# EAGLE design ONET8501P-breakout (EAGLE 9.4.1)
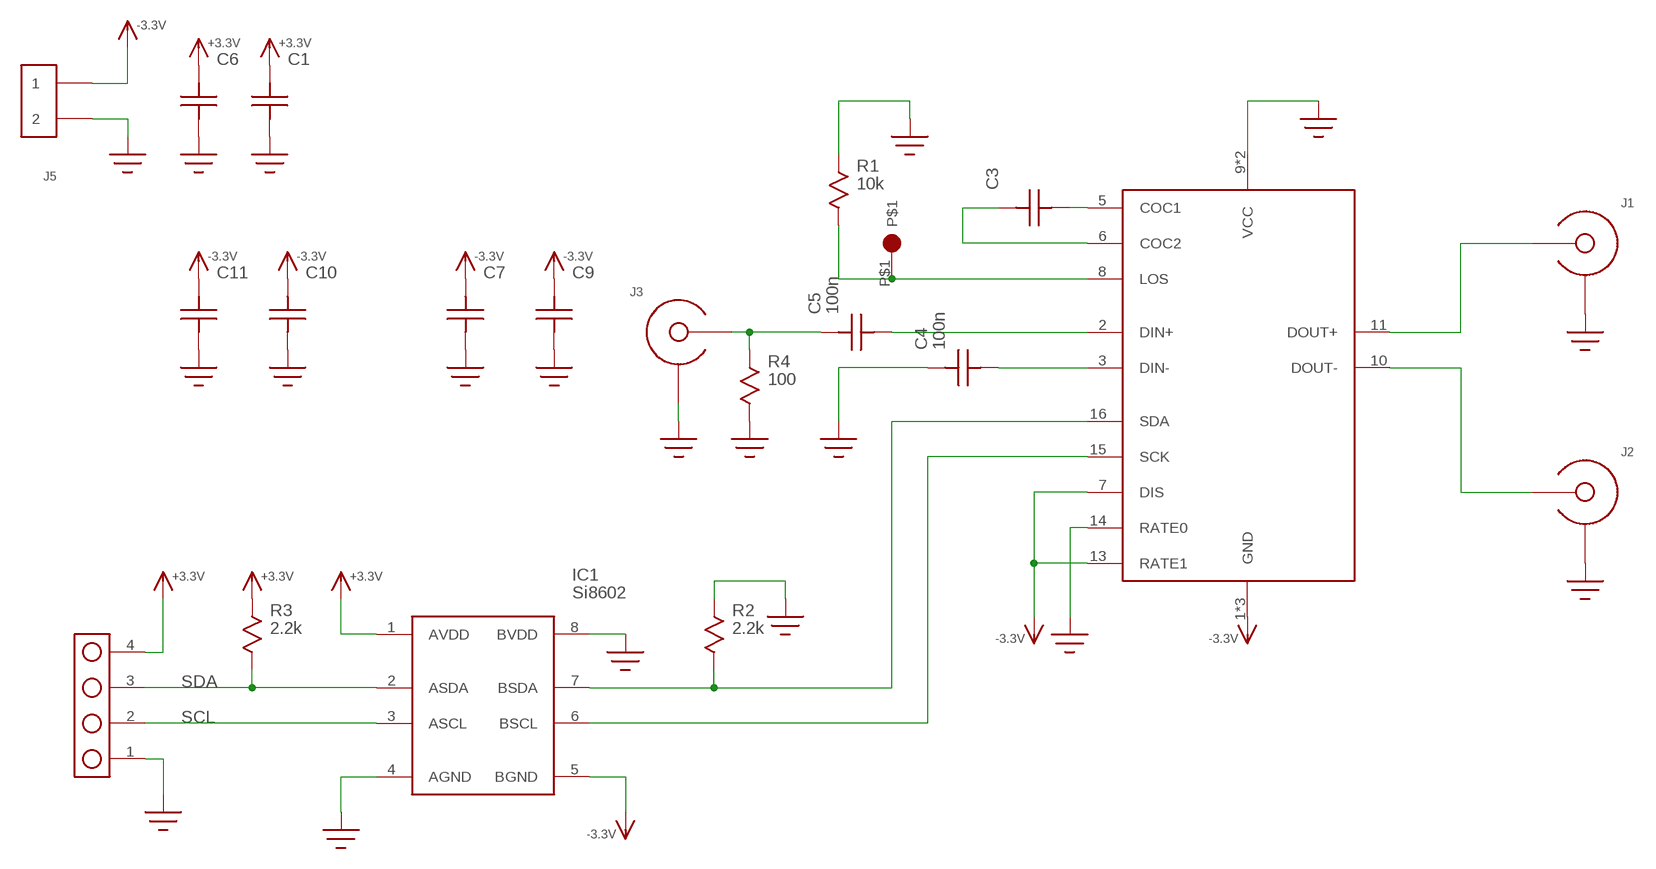
[diagram p0: schematic, sheet 1]

## Parts
C1  C0603  [C0603]
C3  C0603  [C0603]
C4  100n  C0603  [C0603]
C5  100n  C0603  [C0603]
C6  C1206  [1206]
C7  C1206  [1206]
C9  C0603  [C0603]
C10  C0603  [C0603]
C11  C0603  [C0603]
IC1  Si8602  SI8602  [SOIC8]
IC2  ONET8501P  [TQFN16-EP]
J1  SMA-EDGE-LAUNCH4L_4035_TAPER  [SMA_EDGE_LAUNCH_4L_4035_TAPER]
J2  SMA-EDGE-LAUNCH4L_4035_TAPER  [SMA_EDGE_LAUNCH_4L_4035_TAPER]
J3  SMA-EDGE-LAUNCH4L_4035_TAPER  [SMA_EDGE_LAUNCH_4L_4035_TAPER]
J4  HEADER_4PIN  [HEADER_4PIN]
J5  HEADER_2PIN  [HEADER_2PIN]
P1  ICSP_PAD  [ICSP_PAD]
R1  10k  R0603  [R0603]
R2  2.2k  R0603  [R0603]
R3  2.2k  R0603  [R0603]
R4  100  R0603  [R0603]

## Nets
+3.3V: C1.P$2 C6.P$2 IC1.1(AVDD) J4.4 R3.P$1
-3.3V: C7.P$2 C9.P$2 C10.P$2 C11.P$2 IC1.5(BGND) IC2.1(GND) IC2.4(GND) IC2.7(DIS) IC2.13(RATE1) IC2.EP(GND) J5.1
GND: C1.P$1 C4.P$2 C6.P$1 C7.P$1 C9.P$1 C10.P$1 C11.P$1 IC1.4(AGND) IC1.8(BVDD) IC2.9(VCC) IC2.12(VCC) IC2.14(RATE0) J1.BOTTOM_GND(SHIELD) J1.GND@1(SHIELD) J1.GND@2(SHIELD) J1.GND@3(SHIELD) J1.GND@4(SHIELD) J1.GND@5(SHIELD) J1.GND@6(SHIELD) J1.GND@7(SHIELD) J1.GND@8(SHIELD) J1.GND@14(SHIELD) J1.GND@15(SHIELD) J1.GND@16(SHIELD) J1.GND@17(SHIELD) J1.GND_PAD1(SHIELD) J1.GND_PAD2(SHIELD) J1.P$1(SHIELD) J1.P$2(SHIELD) J2.BOTTOM_GND(SHIELD) J2.GND@1(SHIELD) J2.GND@2(SHIELD) J2.GND@3(SHIELD) J2.GND@4(SHIELD) J2.GND@5(SHIELD) J2.GND@6(SHIELD) J2.GND@7(SHIELD) J2.GND@8(SHIELD) J2.GND@14(SHIELD) J2.GND@15(SHIELD) J2.GND@16(SHIELD) J2.GND@17(SHIELD) J2.GND_PAD1(SHIELD) J2.GND_PAD2(SHIELD) J2.P$1(SHIELD) J2.P$2(SHIELD) J3.BOTTOM_GND(SHIELD) J3.GND@1(SHIELD) J3.GND@2(SHIELD) J3.GND@3(SHIELD) J3.GND@4(SHIELD) J3.GND@5(SHIELD) J3.GND@6(SHIELD) J3.GND@7(SHIELD) J3.GND@8(SHIELD) J3.GND@14(SHIELD) J3.GND@15(SHIELD) J3.GND@16(SHIELD) J3.GND@17(SHIELD) J3.GND_PAD1(SHIELD) J3.GND_PAD2(SHIELD) J3.P$1(SHIELD) J3.P$2(SHIELD) J4.1 J5.2 R1.P$1 R2.P$1 R4.P$2
N$3: IC1.7(BSDA) IC2.16(SDA) R2.P$2
N$4: IC1.6(BSCL) IC2.15(SCK)
N$5: C3.P$1 IC2.5(COC1)
N$6: C3.P$2 IC2.6(COC2)
N$7: IC2.11(DOUT+) J1.CENTER@1(CENTER)
N$8: IC2.10(DOUT-) J2.CENTER@1(CENTER)
N$9: IC2.8(LOS) P1.P$1 R1.P$2
N$10: C4.P$1 IC2.3(DIN-)
N$11: C5.P$2 J3.CENTER@1(CENTER) R4.P$1
N$12: C5.P$1 IC2.2(DIN+)
SCL: IC1.3(ASCL) J4.2
SDA: IC1.2(ASDA) J4.3 R3.P$2

## Library data of the parts
C1 C3-C7 C9-C11 = yapo:C
IC1 = yapo:SI8602
IC2 = yapo:ONET8501P
J1-J3 = sma_footprint_2l:SMA-EDGE-LAUNCH
J4 = yapo:HEADER_4PIN
J5 = yapo:HEADER_2PIN
P1 = yapo:ICSP_PAD
R1-R4 = yapo:R

## Board
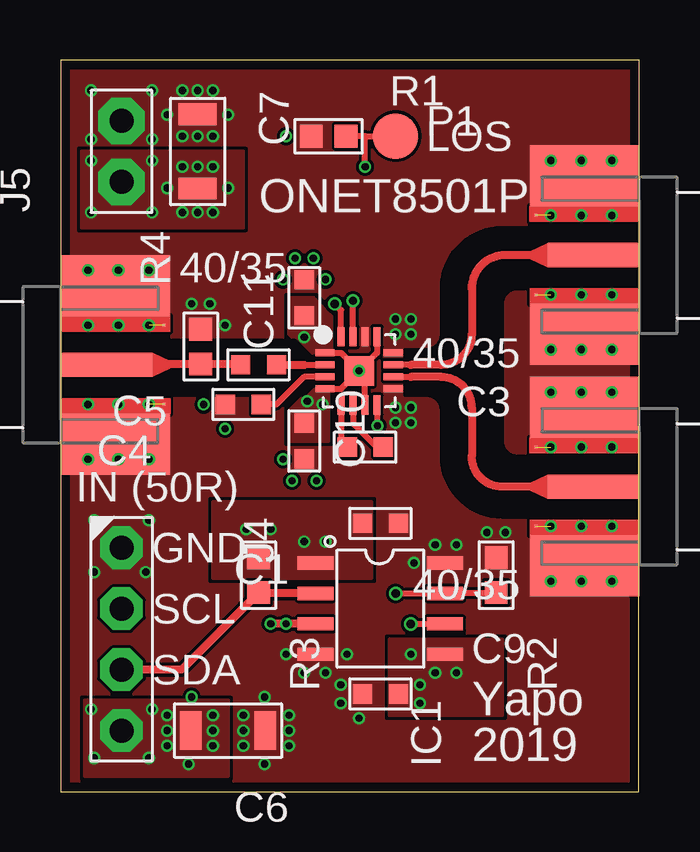
[diagram p1: board, top side]
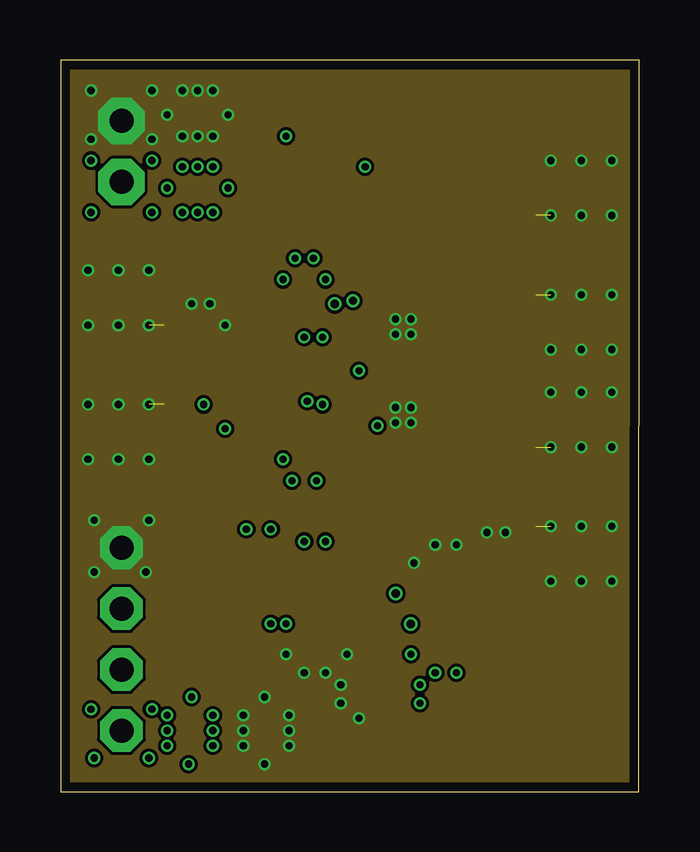
[diagram p2: board, inner layer Route2]
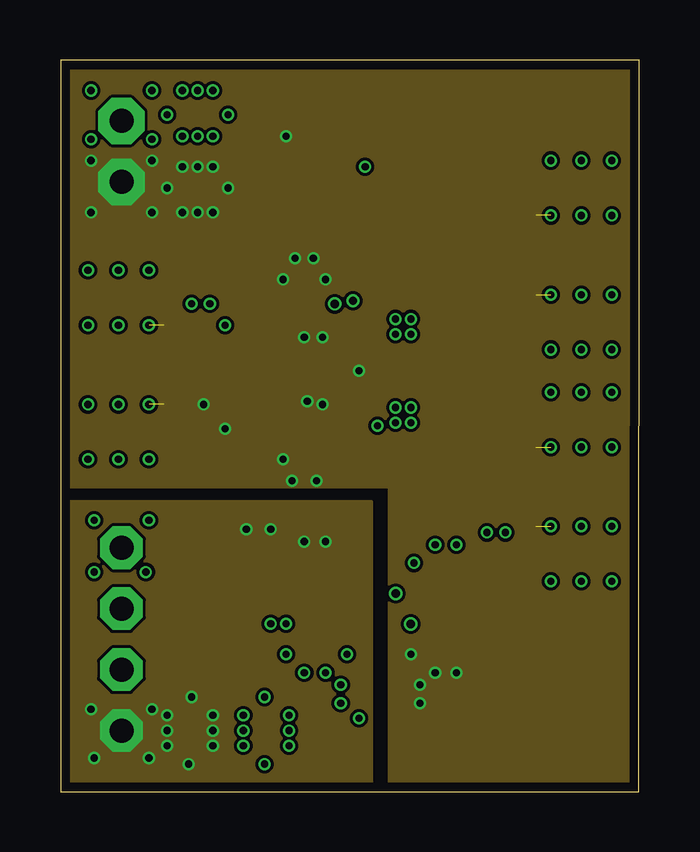
[diagram p3: board, inner layer Route15]
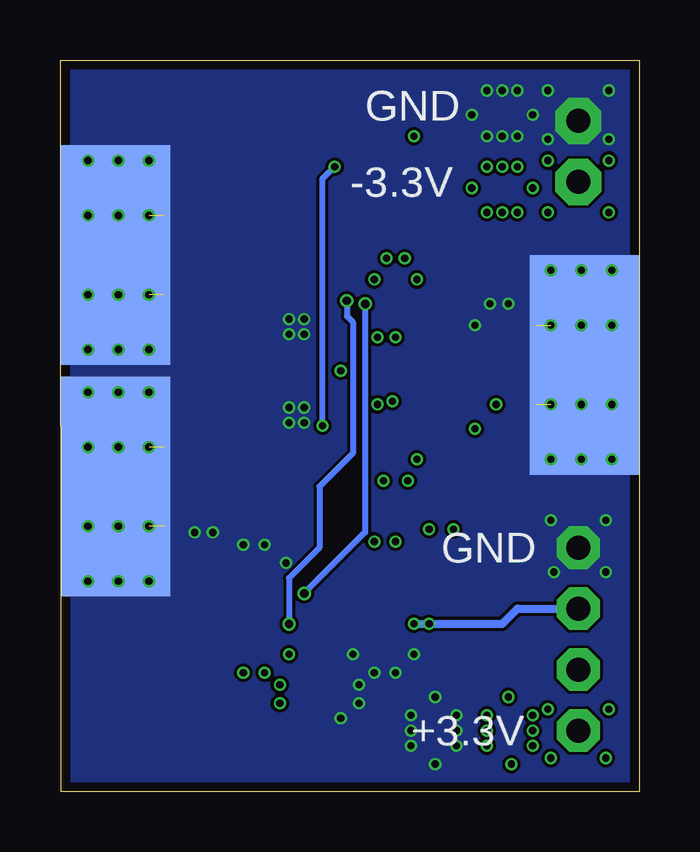
[diagram p4: board, bottom side, seen from below]

Size 24.13 x 30.48 mm. Coordinates in mm from the lower left corner, seen from the top.
Outline: 0,0 24.11,0 24.13,30.48 0,30.48 0,0
Copper layers (1*2*15*16): Top 0.035559375mm / dielectric 0.17018125mm / Route2 0.01778125mm / dielectric 47mil / Route15 0.01778125mm / dielectric 0.17018125mm / Bottom 0.035559375mm
Design rules "oshpark-4layer *": minimum track width 5mil, minimum drill 10mil, track to track 5mil, track to pad 5mil, pad to pad 5mil, via to via 5mil, smd to smd 5mil, copper to edge 15mil, drill to drill 6mil, minimum pad ring 4mil, minimum via ring 4mil, stop-mask expansion 2.5mil, vias tented up to drill 20mil, thermal gap 10mil

### Footprints (pad centres in the part's own frame; a part is rotated, then mirrored left to right if it is on the bottom)
C0603 = smd 0.8 x 0.8: P$1 -0.75,0; P$2 0.75,0
1206 = smd 0.9 x 1.6: P$1 -1.55,0; P$2 1.55,0
SOIC8 = smd 0.55 x 1.5: 1 -1.905,-2.7; 2 -0.635,-2.7; 3 0.635,-2.7; 4 1.905,-2.7; 5 1.905,2.7; 6 0.635,2.7; 7 -0.635,2.7; 8 -1.905,2.7
TQFN16-EP = smd 0.3 x 0.8: 1 -0.75,-1.425; 2 -0.25,-1.425; 3 0.25,-1.425; 4 0.75,-1.425; 9 0.75,1.425; 10 0.25,1.425; 11 -0.25,1.425; 12 -0.75,1.425 | smd 0.8 x 0.3: 5 1.425,-0.75; 6 1.425,-0.25; 7 1.425,0.25; 8 1.425,0.75; 13 -1.425,0.75; 14 -1.425,0.25; 15 -1.425,-0.25; 16 -1.425,-0.75 | smd 1.23 x 1.23: EP 0,0
SMA_EDGE_LAUNCH_4L_4035_TAPER = smd 4.572 x 9.144 bottom: BOTTOM_GND 2.286,0 | smd 3.81 x 1.016: CENTER@1 1.905,0 | drill 0.3: GND@1 1.143,3.937; GND@2 3.683,3.937; GND@3 1.143,1.651; GND@4 3.683,1.651; GND@5 1.143,-1.651; GND@6 3.683,-1.651; GND@7 1.143,-3.937; GND@8 3.683,-3.937; GND@14 2.413,3.937; GND@15 2.413,-3.937; GND@16 2.413,-1.651; GND@17 2.413,1.651 | smd 4.572 x 2.54: GND_PAD1 2.286,3.302; GND_PAD2 2.286,-3.302 | smd 0.127 x 0.127: P$1 4.318,1.651; P$2 4.318,-1.651
HEADER_4PIN = drill 1 pad 1.778 octagon: 1 -3.81,0; 2 -1.27,0; 3 1.27,0; 4 3.81,0
HEADER_2PIN = drill 1 pad 1.93 octagon: 1 -1.27,0; 2 1.27,0
ICSP_PAD = smd 1.905 x 1.905: P$1 0,0
R0603 = smd 0.95 x 0.95: P$1 -0.725,0; P$2 0.725,0

### Placement (x,y rotation side)
C1  13.34,11.18 180 top
C3  12.7,14.35 0 top
C4  7.62,16.13 180 top
C5  8.26,17.78 180 top
C6  6.99,2.54 180 top
C7  5.71,26.67 270 top
C9  13.34,4.06 0 top
C10  10.16,20.57 270 top
C11  10.16,14.61 90 top
IC1  13.34,7.62 270 top
IC2  12.45,17.53 270 top
J1  24.13,22.35 180 top
J2  24.13,12.7 180 top
J3  0,17.78 0 top
J4  2.54,6.35 270 top
J5  2.54,26.67 90 top
P1  13.97,27.3 0 top
R1  11.18,27.3 0 top
R2  18.16,9.02 270 top
R3  8.26,9.02 270 top
R4  5.84,18.54 90 top

### Tracks (layer width: path | path; a pad name or v marks a point on that pad's centre or on a via)
+3.3V  (via drill 0.3)
  other vias: 11.05,10.41 5.46,3.94 5.33,1.14 6.35,1.91 6.35,2.54 6.35,3.17 4.45,3.17 4.45,2.54 4.45,1.91 3.81,3.43 1.27,3.43 1.4,1.4 3.68,1.4 10.16,10.41 7.75,10.92 8.76,10.92
  pour Route15 (no thermals): 0,0 12.95,0 12.95,12.06 0,12.06
  pour Top (no thermals): 6.35,8.89 12.95,8.89 12.95,12.06 6.35,12.06
  pour Top (no thermals): 1.02,0.64 6.99,0.64 6.99,3.81 1.02,3.81
-3.3V  (via drill 0.3)
  Top 0.254: IC2.7 12.7,17.28 IC2.EP | IC2.13 13.2,18.28 IC2.EP | IC2.1 11.7,18.28 IC2.EP | IC2.4 11.7,16.78 IC2.EP
  other vias: 10.92,18.92 10.92,16.13 10.29,16.26 10.16,18.92 12.45,17.53 5.71,26.04 5.71,24.13 5.08,26.04 6.35,26.04 6.35,24.13 5.08,24.13 4.45,25.15 6.99,25.15 3.81,24.13 1.27,24.13 1.27,26.29 3.81,26.29 9.4,27.3 9.78,22.23 10.54,22.23 11.05,21.34 9.27,21.34 6.86,15.11 5.97,16.13 9.27,13.84 9.65,12.95 10.67,12.95 15.62,4.95 16.51,4.95 14.99,4.45 14.61,5.71 14.99,3.68
  pour Route15 (no thermals): 0,30.48 24.13,30.48 24.13,0 13.72,0 13.72,12.7 0,12.7
  pour Top (no thermals): 13.72,6.35 13.72,3.17 18.41,3.17 18.41,6.35
  pour Top (no thermals): 9.53,14.61 11.18,14.61 11.18,16.76 10.41,16.76 9.53,15.88
  pour Top (no thermals): 9.53,20.57 10.54,20.57 11.3,19.81 11.3,18.29 10.16,18.29 10.16,18.41 9.53,19.05
  pour Top (no thermals): 0.89,26.67 7.62,26.67 7.62,23.5 0.89,23.5
GND  (via drill 0.3)  (6 unrouted)
  other vias: 13.97,19.05 13.97,16 14.61,19.05 14.61,19.68 13.97,19.68 14.61,16 14.61,15.37 13.97,15.37 6.86,19.43 6.22,20.32 5.46,20.32 5.08,27.3 5.71,27.3 6.35,27.3 6.99,28.19 4.45,28.19 5.08,29.21 5.71,29.21 6.35,29.21 3.81,29.21 1.27,29.21 1.27,27.18 3.81,27.18 18.54,10.79 17.78,10.79 15.62,10.29 16.51,10.29 11.94,5.71 14.73,9.53 9.4,5.71 10.16,4.95 11.05,4.95 11.68,4.45 11.68,3.68 12.45,3.05 8.51,3.94 8.51,1.14 9.53,3.17 9.53,2.54 9.53,1.91 7.62,2.54 7.62,3.17 7.62,1.91 3.68,11.3 3.56,9.14 1.4,11.3 1.4,9.14
  pour Top (rank 2, no thermals): 0,0 24.13,0 24.13,30.48 0,30.48
  pour Route2 (no thermals): 0,0 24.13,0 24.13,30.48 0,30.48
  pour Bottom (no thermals): 0,0 24.13,0 24.13,30.48 0,30.48
  cutout Top (no thermals): 19.68,23.5 18.41,23.5 arc90 15.88,20.95 15.88,19.05 arc-90 15.24,18.41 14.35,18.41 14.35,16.51 15.24,16.51 arc-90 15.88,15.88 15.88,13.97 arc90 18.41,11.43 19.68,11.43 19.68,13.97 19.05,13.97 arc-90 18.41,14.61 18.41,20.32 arc-90 19.05,20.95 19.68,20.95
  cutout Top (no thermals): 4.45,18.8 9.78,18.8 10.79,17.78 10.79,17.14 10.16,16.51 4.45,16.51
N$3  (via drill 0.35)
  Top 0.254: v13.97,8.26 IC1.7 16.07,8.29 R2.P$2 | IC2.16 11.7,20.05 v11.43,20.32
  Bottom 0.254: v13.97,8.26 11.43,10.79 v11.43,20.32
N$4  (via drill 0.35)
  Top 0.254: IC2.15 v12.2,20.44 v12.19,20.45 | v14.61,6.99 IC1.6
  Bottom 0.254: v12.19,20.45 12.19,19.81 11.94,19.56 11.94,14.1 13.34,12.7 13.34,10.16 14.61,8.89 v14.61,6.99
N$5
  Top 0.254: IC2.5 11.7,14.61 C3.P$1
N$6
  Top 0.254: IC2.6 12.2,15.35 13.2,14.35 C3.P$2
N$7
  Top 0.254: IC2.11 arc-90 IC2.11 14.61,17.78
  Top 0.343: J1.CENTER@1 18.54,22.35 arc90 17.14,20.95 17.14,19.05 arc-90 15.88,17.78 14.61,17.78
N$8
  Top 0.254: IC2.10 14.6,17.28 arc-90 14.61,17.27
  Top 0.343: J2.CENTER@1 18.41,12.7 arc-90 17.14,13.97 17.14,16 arc90 15.88,17.27 14.61,17.27
N$9  (via drill 0.3)
  Top 0.254: IC2.8 13.2,15.25 v13.21,15.24 | v12.7,26.04 12.7,27.3 | 12.7,27.3 R1.P$2 | 12.7,27.3 P1.P$1
  Bottom 0.254: v13.21,15.24 13.21,25.53 v12.7,26.04
N$10
  Top 0.254: IC2.3 10.15,17.28 9.01,16.13 C4.P$1
N$11
  Top 0.343: J3.CENTER@1 1.91,17.82 R4.P$1 7.5,17.82 C5.P$2
N$12
  Top 0.254: 10.16,17.78 IC2.2
  Top 0.343: C5.P$1 10.16,17.78
SCL  (via drill 0.3)
  Top 0.343: IC1.3 v9.4,6.99 v8.76,6.99
  Bottom 0.343: v9.4,6.99 5.71,6.99 5.08,7.62 J4.2
SDA
  Top 0.343: IC1.2 8.29,8.26 R3.P$2 5.04,5.08 J4.3

### Text on the board
tPlace: LOS | ONET8501P | IN (50R) | GND | SCL | SDA | Yapo | 2019
bPlace: GND | -3.3V | GND | +3.3V